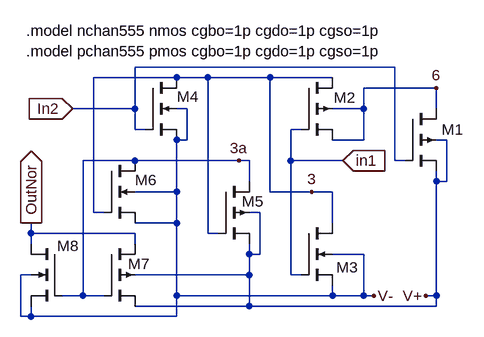
[diagram p0: schematic Nor.asc]
Nor.asc, the LTspice schematic file:
Version 4
SHEET 1 880 680
WIRE -544 496 -544 432
WIRE -528 368 -528 352
WIRE -528 384 -528 368
WIRE -528 432 -544 432
WIRE -528 496 -544 496
WIRE -528 496 -528 480
WIRE -448 464 -480 464
WIRE -448 464 -448 256
WIRE -432 336 -432 128
WIRE -416 336 -432 336
WIRE -416 464 -448 464
WIRE -368 176 -464 176
WIRE -368 176 -368 112
WIRE -368 208 -368 176
WIRE -368 256 -448 256
WIRE -368 368 -528 368
WIRE -368 384 -368 368
WIRE -352 208 -368 208
WIRE -304 128 -432 128
WIRE -304 304 -368 304
WIRE -304 304 -304 224
WIRE -304 352 -368 352
WIRE -304 352 -304 304
WIRE -304 464 -304 352
WIRE -304 496 -528 496
WIRE -304 496 -304 464
WIRE -288 176 -304 176
WIRE -288 224 -304 224
WIRE -288 224 -288 176
WIRE -256 128 -304 128
WIRE -256 368 -256 128
WIRE -240 368 -256 368
WIRE -208 256 -368 256
WIRE -192 256 -208 256
WIRE -192 288 -192 256
WIRE -192 400 -192 384
WIRE -192 432 -368 432
WIRE -192 432 -192 400
WIRE -192 480 -368 480
WIRE -192 480 -192 432
WIRE -176 336 -192 336
WIRE -176 400 -192 400
WIRE -176 400 -176 336
WIRE -160 128 -256 128
WIRE -160 304 -160 128
WIRE -128 256 -128 208
WIRE -128 432 -128 256
WIRE -112 208 -128 208
WIRE -112 432 -128 432
WIRE -96 304 -160 304
WIRE -64 128 -160 128
WIRE -64 304 -96 304
WIRE -64 352 -64 304
WIRE -64 464 -304 464
WIRE -64 464 -64 448
WIRE -48 256 -128 256
WIRE -16 176 -64 176
WIRE -16 176 -16 144
WIRE -16 224 -64 224
WIRE -16 224 -16 176
WIRE -16 400 -64 400
WIRE -16 464 -64 464
WIRE -16 464 -16 400
WIRE 0 464 -16 464
WIRE 32 112 -368 112
WIRE 32 256 32 112
WIRE 48 256 32 256
WIRE 96 144 -16 144
WIRE 96 176 96 144
WIRE 96 288 96 272
WIRE 96 464 80 464
WIRE 96 464 96 288
WIRE 96 480 -192 480
WIRE 96 480 96 464
WIRE 112 224 96 224
WIRE 112 288 96 288
WIRE 112 288 112 224
FLAG 96 144 6
FLAG -464 176 In2
IOPIN -464 176 In
FLAG -48 256 in1
IOPIN -48 256 In
FLAG 0 464 V-
FLAG -208 256 3a
FLAG 80 464 V+
FLAG -528 352 OutNor
IOPIN -528 352 Out
FLAG -96 304 3
SYMBOL pmos4 48 176 R0
WINDOW 3 56 72 Invisible 0
SYMATTR Value Pchan555
SYMATTR InstName M1
SYMATTR Value2 l=2u w=1000u
SYMBOL pmos4 -112 128 R0
WINDOW 3 56 72 Invisible 0
WINDOW 0 50 31 Left 0
SYMATTR Value Pchan555
SYMATTR InstName M2
SYMATTR Value2 l=2u w=1000u
SYMBOL nmos4 -112 352 R0
WINDOW 3 56 72 Invisible 0
WINDOW 0 54 68 Left 0
SYMATTR Value Nchan555
SYMATTR InstName M3
SYMATTR Value2 l=2u w=1000u
SYMBOL nmos4 -352 128 R0
WINDOW 3 56 72 Invisible 0
WINDOW 0 49 29 Left 0
SYMATTR Value Nchan555
SYMATTR InstName M4
SYMATTR Value2 l=2u w=1000u
SYMBOL pmos4 -240 288 R0
WINDOW 0 37 31 Left 0
WINDOW 3 56 72 Invisible 0
SYMATTR InstName M5
SYMATTR Value Pchan555
SYMATTR Value2 l=2u w=1000u
SYMBOL nmos4 -416 256 R0
WINDOW 3 56 72 Invisible 0
WINDOW 0 48 30 Left 0
SYMATTR Value Nchan555
SYMATTR InstName M6
SYMATTR Value2 l=2u w=1000u
SYMBOL pmos4 -416 384 R0
WINDOW 0 37 31 Left 0
WINDOW 3 56 72 Invisible 0
SYMATTR InstName M7
SYMATTR Value Pchan555
SYMATTR Value2 l=2u w=1000u
SYMBOL nmos4 -480 384 M0
WINDOW 0 -26 3 Left 0
WINDOW 3 56 72 Invisible 0
SYMATTR InstName M8
SYMATTR Value Nchan555
SYMATTR Value2 l=2u w=1000u
TEXT -536 56 Left 0 !.model nchan555 nmos cgbo=1p cgdo=1p cgso=1p\n.model pchan555 pmos cgbo=1p cgdo=1p cgso=1p

The netlist it stands for:
* Nor.asc
M1 6 In2 V+ V+ Pchan555 l=2u w=1000u
M2 3 in1 6 6 Pchan555 l=2u w=1000u
M3 3 in1 V- V- Nchan555 l=2u w=1000u
M4 3 In2 V- V- Nchan555 l=2u w=1000u
M5 3a 3 V+ V+ Pchan555 l=2u w=1000u
M6 3a 3 V- V- Nchan555 l=2u w=1000u
M7 OutNor 3a V+ V+ Pchan555 l=2u w=1000u
M8 OutNor 3a V- V- Nchan555 l=2u w=1000u
.model NMOS NMOS
.model PMOS PMOS
.lib standard.mos
.model nchan555 nmos cgbo=1p cgdo=1p cgso=1p
.model pchan555 pmos cgbo=1p cgdo=1p cgso=1p
.backanno
.end